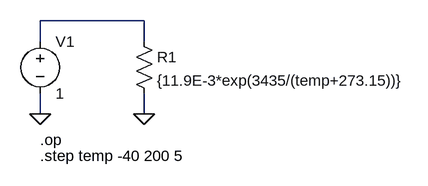
[diagram p0: schematic termistorntc.asc]
termistorntc.asc, the LTspice schematic file:
Version 4.1
SHEET 1 880 680
WIRE 272 80 112 80
WIRE 112 112 112 80
WIRE 272 112 272 80
WIRE 112 224 112 192
WIRE 272 224 272 192
FLAG 272 224 0
FLAG 112 224 0
SYMBOL res 256 96 R0
SYMATTR InstName R1
SYMATTR Value {11.9E-3*exp(3435/(temp+273.15))}
SYMBOL voltage 112 96 R0
WINDOW 123 0 0 Left 0
WINDOW 39 0 0 Left 0
SYMATTR InstName V1
SYMATTR Value 1
TEXT 112 264 Left 2 !.op
TEXT 112 288 Left 2 !.step temp -40 200 5

The netlist it stands for:
* termistorntc.asc
R1 N001 0 {11.9E-3*exp(3435/(temp+273.15))}
V1 N001 0 1
.op
.step temp -40 200 5
.backanno
.end